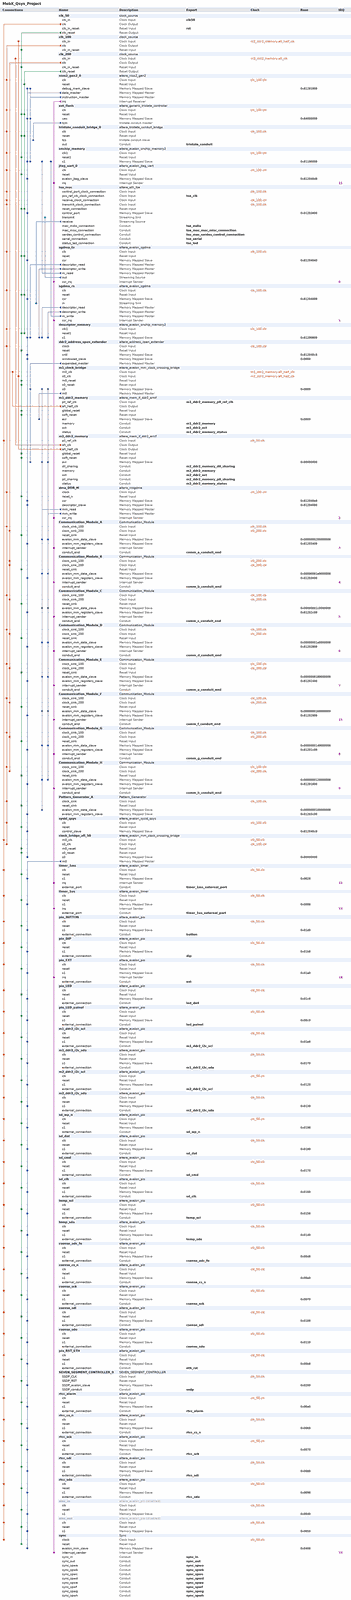
[diagram p0: system contents, whole]
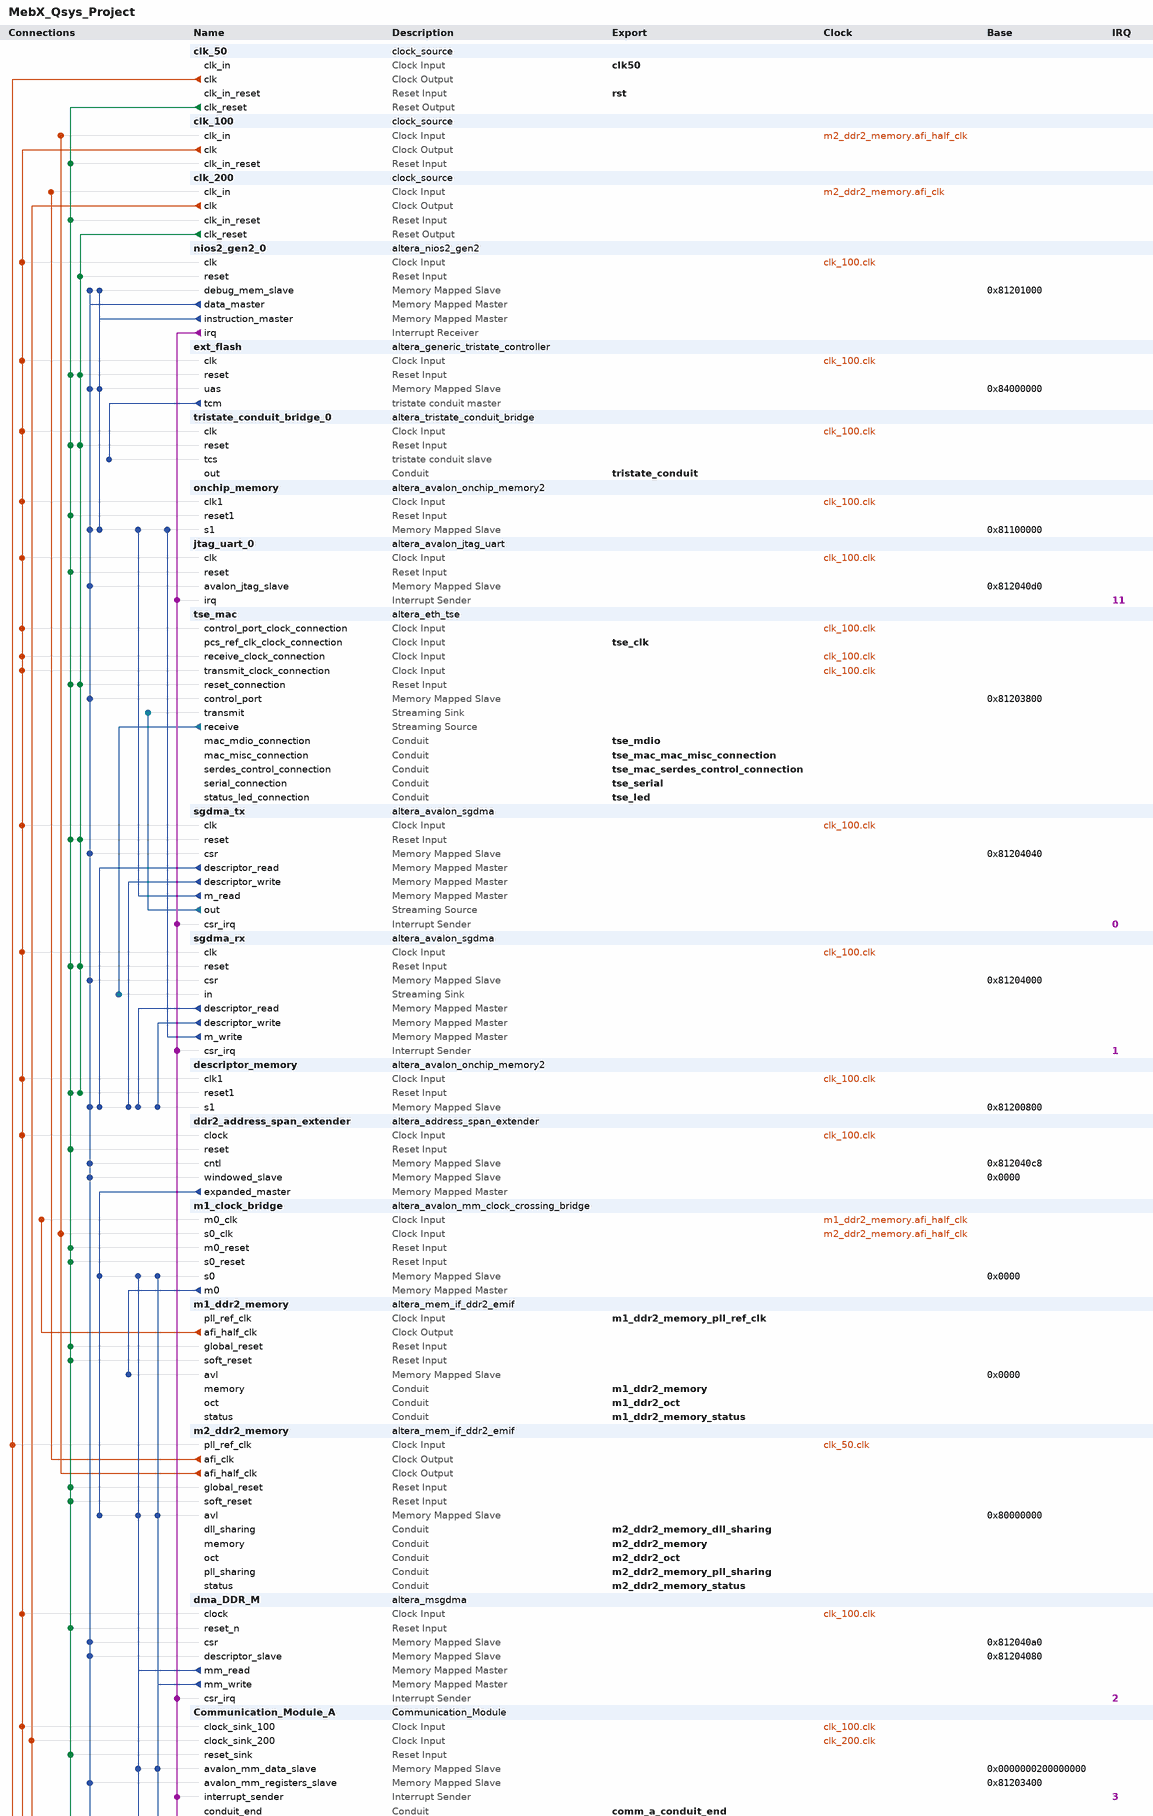
[diagram p1: system contents, upper part]
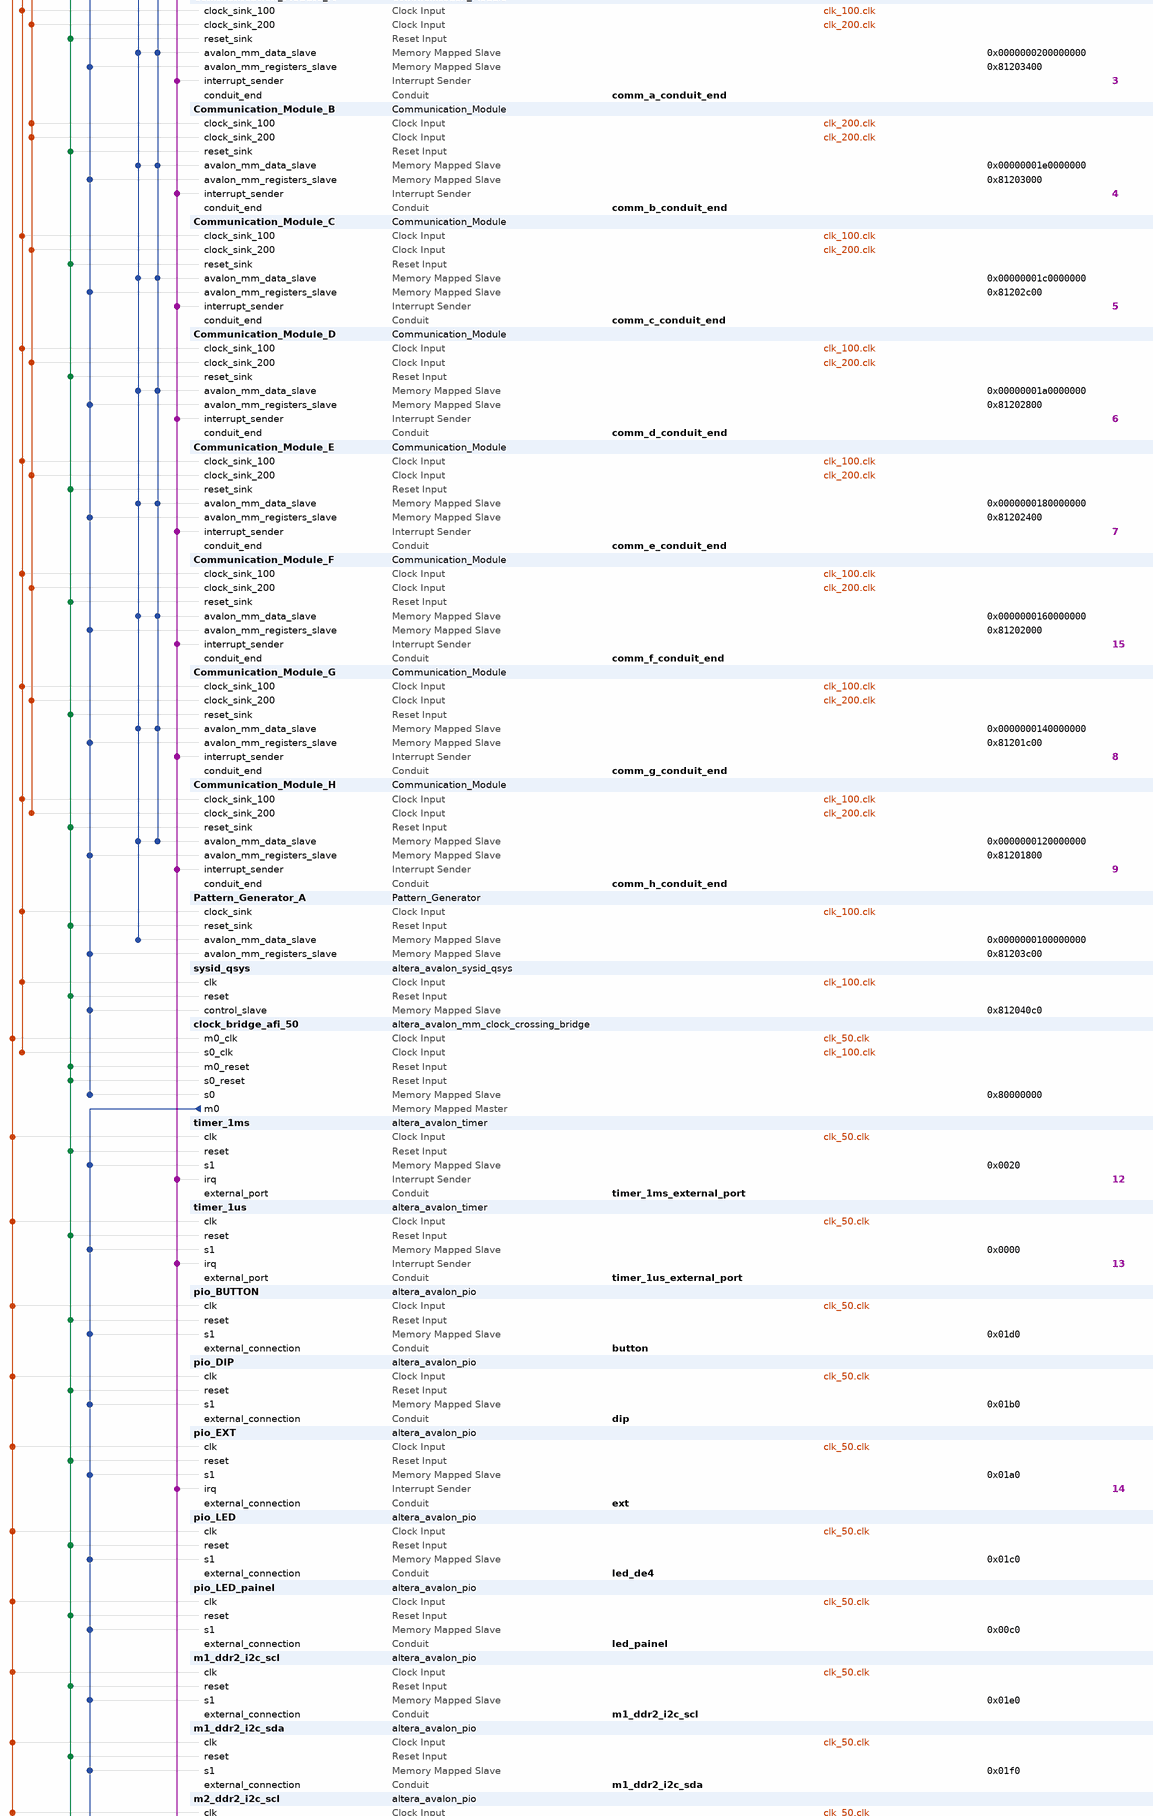
[diagram p2: system contents, middle part]
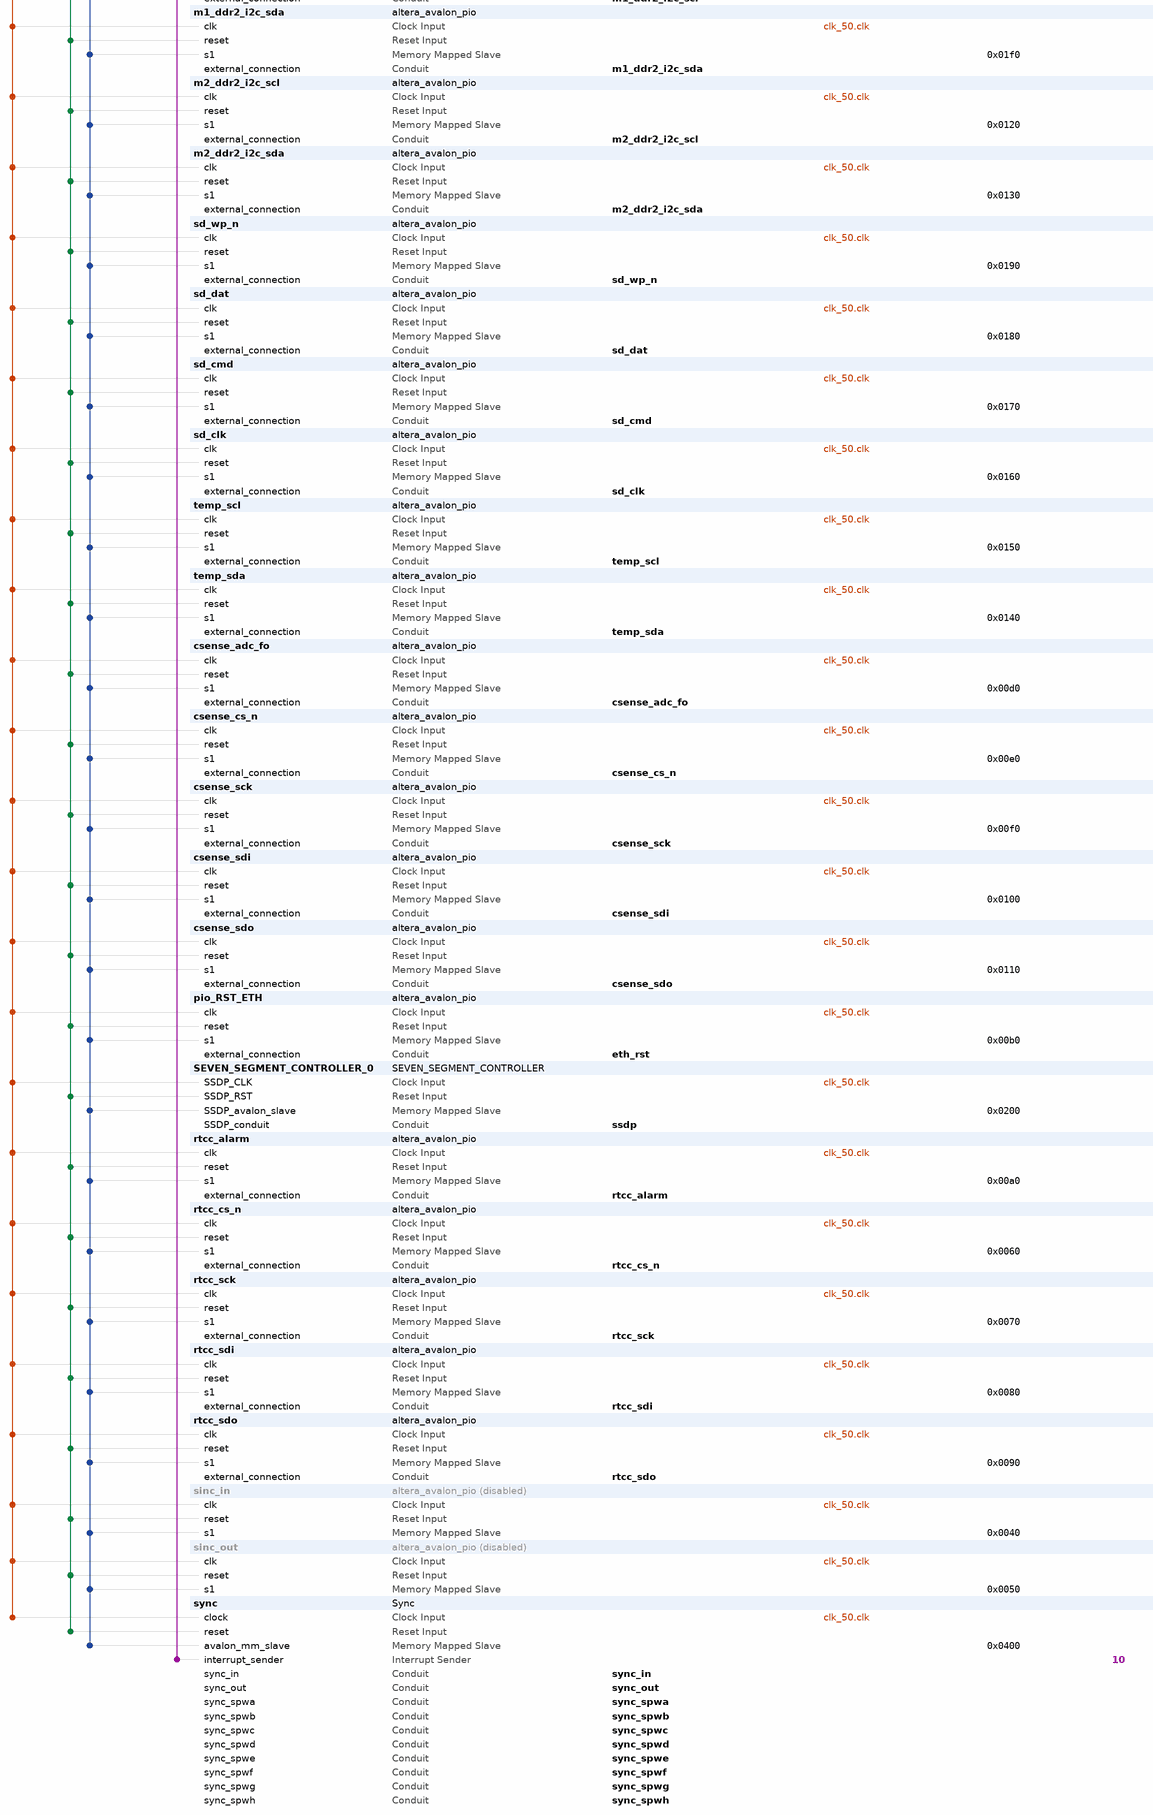
[diagram p3: system contents, lower part]
# Platform Designer (Qsys) system MebX_Qsys_Project, Stratix IV EP4SGX230KF40C2
# Parameters at their usual value, and those the tool derives, are not listed.
package require -exact qsys 16.1
create_system MebX_Qsys_Project
set_project_property DEVICE_FAMILY {Stratix IV}
set_project_property DEVICE EP4SGX230KF40C2

add_instance clk_50 clock_source 16.1
set_instance_parameter_value clk_50 clockFrequency 50000000

add_instance clk_100 clock_source 16.1
set_instance_parameter_value clk_100 clockFrequency 100000000

add_instance clk_200 clock_source 16.1
set_instance_parameter_value clk_200 clockFrequency 200000000

add_instance nios2_gen2_0 altera_nios2_gen2 16.1
set_instance_parameter_value nios2_gen2_0 dcache_size 0
set_instance_parameter_value nios2_gen2_0 debug_hwbreakpoint 2
set_instance_parameter_value nios2_gen2_0 dividerType srt2
set_instance_parameter_value nios2_gen2_0 exceptionSlave onchip_memory.s1
set_instance_parameter_value nios2_gen2_0 icache_burstType Sequential
set_instance_parameter_value nios2_gen2_0 icache_size 4096
set_instance_parameter_value nios2_gen2_0 impl Fast
set_instance_parameter_value nios2_gen2_0 mul_64_impl 1
set_instance_parameter_value nios2_gen2_0 mul_shift_choice 1
set_instance_parameter_value nios2_gen2_0 resetOffset 33685504
set_instance_parameter_value nios2_gen2_0 resetSlave ext_flash.uas
set_instance_parameter_value nios2_gen2_0 setting_support31bitdcachebypass false

add_instance ext_flash altera_generic_tristate_controller 16.1
set_instance_parameter_value ext_flash ACTIVE_LOW_BEGINTRANSFER 0
set_instance_parameter_value ext_flash ACTIVE_LOW_BYTEENABLE 0
set_instance_parameter_value ext_flash ACTIVE_LOW_OUTPUTENABLE 0
set_instance_parameter_value ext_flash ACTIVE_LOW_READ 1
set_instance_parameter_value ext_flash CHIPSELECT_THROUGH_READLATENCY 0
set_instance_parameter_value ext_flash INTERFACE_ASSIGNMENT_KEYS embeddedsw.configuration.isFlash,embeddedsw.configuration.isNonVolatileStorage,embeddedsw.configuration.isMemoryDevice
set_instance_parameter_value ext_flash INTERFACE_ASSIGNMENT_VALUES 1,1,1
set_instance_parameter_value ext_flash MODULE_ASSIGNMENT_KEYS embeddedsw.configuration.hwClassnameDriverSupportList,embeddedsw.configuration.hwClassnameDriverSupportDefault,embeddedsw.CMacro.SETUP_VALUE,embeddedsw.CMacro.WAIT_VALUE,embeddedsw.CMacro.HOLD_VALUE,embeddedsw.CMacro.TIMING_UNITS,embeddedsw.CMacro.SIZE,embeddedsw.memoryInfo.MEM_INIT_DATA_WIDTH,embeddedsw.memoryInfo.HAS_BYTE_LANE,embeddedsw.memoryInfo.IS_FLASH,embeddedsw.memoryInfo.GENERATE_DAT_SYM,embeddedsw.memoryInfo.GENERATE_FLASH,embeddedsw.memoryInfo.DAT_SYM_INSTALL_DIR,embeddedsw.memoryInfo.FLASH_INSTALL_DIR
set_instance_parameter_value ext_flash MODULE_ASSIGNMENT_VALUES "altera_avalon_lan91c111\\,altera_avalon_cfi_flash,altera_avalon_cfi_flash,25,100,20,\"ns\",33554432u,16,1,1,1,1,SIM_DIR,APP_DIR"
set_instance_parameter_value ext_flash TCM_ADDRESS_W 26
set_instance_parameter_value ext_flash TCM_BYTEENABLE_W 2
set_instance_parameter_value ext_flash TCM_DATA_HOLD 20
set_instance_parameter_value ext_flash TCM_DATA_W 16
set_instance_parameter_value ext_flash TCM_MAX_PENDING_READ_TRANSACTIONS 3
set_instance_parameter_value ext_flash TCM_READLATENCY 2
set_instance_parameter_value ext_flash TCM_READ_WAIT 100
set_instance_parameter_value ext_flash TCM_SETUP_WAIT 25
set_instance_parameter_value ext_flash TCM_SYMBOLS_PER_WORD 2
set_instance_parameter_value ext_flash TCM_TIMING_UNITS 0
set_instance_parameter_value ext_flash TCM_TURNAROUND_TIME 2
set_instance_parameter_value ext_flash TCM_WRITE_WAIT 100
set_instance_parameter_value ext_flash USE_BEGINTRANSFER 0
set_instance_parameter_value ext_flash USE_BYTEENABLE 0
set_instance_parameter_value ext_flash USE_OUTPUTENABLE 0
set_instance_parameter_value ext_flash USE_READ 1

add_instance tristate_conduit_bridge_0 altera_tristate_conduit_bridge 16.1

add_instance onchip_memory altera_avalon_onchip_memory2 16.1
set_instance_parameter_value onchip_memory blockType M9K
set_instance_parameter_value onchip_memory dataWidth 32
set_instance_parameter_value onchip_memory dualPort false
set_instance_parameter_value onchip_memory initMemContent false
set_instance_parameter_value onchip_memory initializationFileName onchip_mem.hex
set_instance_parameter_value onchip_memory memorySize 1024000

add_instance jtag_uart_0 altera_avalon_jtag_uart 16.1
set_instance_parameter_value jtag_uart_0 simInteractiveOptions NO_INTERACTIVE_WINDOWS

add_instance tse_mac altera_eth_tse 16.1
set_instance_parameter_value tse_mac core_variation MAC_PCS
set_instance_parameter_value tse_mac ena_hash true
set_instance_parameter_value tse_mac enable_hd_logic true
set_instance_parameter_value tse_mac enable_mac_flow_ctrl true
set_instance_parameter_value tse_mac enable_mac_vlan true
set_instance_parameter_value tse_mac enable_magic_detect true
set_instance_parameter_value tse_mac enable_sgmii true
set_instance_parameter_value tse_mac enable_shift16 true
set_instance_parameter_value tse_mac enable_sup_addr true
set_instance_parameter_value tse_mac ifGMII MII_GMII
set_instance_parameter_value tse_mac ing_addr 11
set_instance_parameter_value tse_mac mdio_clk_div 40
set_instance_parameter_value tse_mac phy_identifier 3
set_instance_parameter_value tse_mac stat_cnt_ena true
set_instance_parameter_value tse_mac transceiver_type LVDS_IO

add_instance sgdma_tx altera_avalon_sgdma 16.1
set_instance_parameter_value sgdma_tx enableBurstTransfers false
set_instance_parameter_value sgdma_tx enableUnalignedTransfers false
set_instance_parameter_value sgdma_tx readBlockDataWidth 32
set_instance_parameter_value sgdma_tx sinkErrorWidth 0
set_instance_parameter_value sgdma_tx sourceErrorWidth 0
set_instance_parameter_value sgdma_tx transferMode MEMORY_TO_STREAM
set_instance_parameter_value sgdma_tx writeBurstcountWidth 4

add_instance sgdma_rx altera_avalon_sgdma 16.1
set_instance_parameter_value sgdma_rx enableBurstTransfers false
set_instance_parameter_value sgdma_rx enableUnalignedTransfers false
set_instance_parameter_value sgdma_rx readBlockDataWidth 32
set_instance_parameter_value sgdma_rx sinkErrorWidth 0
set_instance_parameter_value sgdma_rx sourceErrorWidth 0
set_instance_parameter_value sgdma_rx transferMode STREAM_TO_MEMORY
set_instance_parameter_value sgdma_rx writeBurstcountWidth 4

add_instance descriptor_memory altera_avalon_onchip_memory2 16.1
set_instance_parameter_value descriptor_memory dataWidth 32
set_instance_parameter_value descriptor_memory dualPort false
set_instance_parameter_value descriptor_memory initMemContent true
set_instance_parameter_value descriptor_memory initializationFileName onchip_mem.hex
set_instance_parameter_value descriptor_memory memorySize 2048

add_instance ddr2_address_span_extender altera_address_span_extender 16.1
set_instance_parameter_value ddr2_address_span_extender BURSTCOUNT_WIDTH 8
set_instance_parameter_value ddr2_address_span_extender DATA_WIDTH 32
set_instance_parameter_value ddr2_address_span_extender ENABLE_SLAVE_PORT true
set_instance_parameter_value ddr2_address_span_extender MASTER_ADDRESS_DEF 0
set_instance_parameter_value ddr2_address_span_extender MAX_PENDING_READS 8
set_instance_parameter_value ddr2_address_span_extender SLAVE_ADDRESS_WIDTH 29

add_instance m1_clock_bridge altera_avalon_mm_clock_crossing_bridge 16.1
set_instance_parameter_value m1_clock_bridge ADDRESS_WIDTH 31
set_instance_parameter_value m1_clock_bridge COMMAND_FIFO_DEPTH 4
set_instance_parameter_value m1_clock_bridge DATA_WIDTH 64
set_instance_parameter_value m1_clock_bridge MASTER_SYNC_DEPTH 2
set_instance_parameter_value m1_clock_bridge MAX_BURST_SIZE 16
set_instance_parameter_value m1_clock_bridge RESPONSE_FIFO_DEPTH 64
set_instance_parameter_value m1_clock_bridge SLAVE_SYNC_DEPTH 2
set_instance_parameter_value m1_clock_bridge USE_AUTO_ADDRESS_WIDTH 1

add_instance m1_ddr2_memory altera_mem_if_ddr2_emif 16.1
set_instance_parameter_value m1_ddr2_memory AVL_MAX_SIZE 128
set_instance_parameter_value m1_ddr2_memory CALIBRATION_MODE Full
set_instance_parameter_value m1_ddr2_memory DLL_SHARING_MODE None
set_instance_parameter_value m1_ddr2_memory EXPORT_AFI_HALF_CLK true
set_instance_parameter_value m1_ddr2_memory MEM_BANKADDR_WIDTH 3
set_instance_parameter_value m1_ddr2_memory MEM_CLK_FREQ 400.0
set_instance_parameter_value m1_ddr2_memory MEM_COL_ADDR_WIDTH 10
set_instance_parameter_value m1_ddr2_memory MEM_DQ_WIDTH 64
set_instance_parameter_value m1_ddr2_memory MEM_NUMBER_OF_RANKS_PER_DIMM 2
set_instance_parameter_value m1_ddr2_memory MEM_ROW_ADDR_WIDTH 14
set_instance_parameter_value m1_ddr2_memory MEM_TCL 4
set_instance_parameter_value m1_ddr2_memory MEM_TRAS_NS 40.0
set_instance_parameter_value m1_ddr2_memory PLL_SHARING_MODE None
set_instance_parameter_value m1_ddr2_memory POWER_OF_TWO_BUS true
set_instance_parameter_value m1_ddr2_memory REF_CLK_FREQ 50.0
set_instance_parameter_value m1_ddr2_memory TIMING_TDQSQ 200
set_instance_parameter_value m1_ddr2_memory TIMING_TIH 375
set_instance_parameter_value m1_ddr2_memory TIMING_TQHS 300
set_instance_parameter_value m1_ddr2_memory USER_DEBUG_LEVEL 0

add_instance m2_ddr2_memory altera_mem_if_ddr2_emif 16.1
set_instance_parameter_value m2_ddr2_memory AVL_MAX_SIZE 128
set_instance_parameter_value m2_ddr2_memory CALIBRATION_MODE Full
set_instance_parameter_value m2_ddr2_memory DLL_SHARING_MODE Master
set_instance_parameter_value m2_ddr2_memory EXPORT_AFI_HALF_CLK true
set_instance_parameter_value m2_ddr2_memory MEM_BANKADDR_WIDTH 3
set_instance_parameter_value m2_ddr2_memory MEM_CLK_FREQ 400.0
set_instance_parameter_value m2_ddr2_memory MEM_COL_ADDR_WIDTH 10
set_instance_parameter_value m2_ddr2_memory MEM_DQ_WIDTH 64
set_instance_parameter_value m2_ddr2_memory MEM_NUMBER_OF_RANKS_PER_DIMM 2
set_instance_parameter_value m2_ddr2_memory MEM_ROW_ADDR_WIDTH 14
set_instance_parameter_value m2_ddr2_memory MEM_TCL 4
set_instance_parameter_value m2_ddr2_memory MEM_TRAS_NS 40.0
set_instance_parameter_value m2_ddr2_memory PLL_SHARING_MODE Master
set_instance_parameter_value m2_ddr2_memory POWER_OF_TWO_BUS true
set_instance_parameter_value m2_ddr2_memory REF_CLK_FREQ 50.0
set_instance_parameter_value m2_ddr2_memory TIMING_TDQSQ 200
set_instance_parameter_value m2_ddr2_memory TIMING_TIH 375
set_instance_parameter_value m2_ddr2_memory TIMING_TQHS 300
set_instance_parameter_value m2_ddr2_memory USER_DEBUG_LEVEL 0

add_instance dma_DDR_M altera_msgdma 16.1
set_instance_parameter_value dma_DDR_M BURST_ENABLE 1
set_instance_parameter_value dma_DDR_M DATA_FIFO_DEPTH 64
set_instance_parameter_value dma_DDR_M DATA_WIDTH 64
set_instance_parameter_value dma_DDR_M DESCRIPTOR_FIFO_DEPTH 32
set_instance_parameter_value dma_DDR_M ENHANCED_FEATURES 1
set_instance_parameter_value dma_DDR_M ERROR_ENABLE 0
set_instance_parameter_value dma_DDR_M MAX_BURST_COUNT 16
set_instance_parameter_value dma_DDR_M MAX_BYTE 67108864
set_instance_parameter_value dma_DDR_M MODE 0
set_instance_parameter_value dma_DDR_M PACKET_ENABLE 0
set_instance_parameter_value dma_DDR_M TRANSFER_TYPE {Aligned Accesses}

add_instance Communication_Module_A Communication_Module 1.4

add_instance Communication_Module_B Communication_Module 1.4

add_instance Communication_Module_C Communication_Module 1.4

add_instance Communication_Module_D Communication_Module 1.4

add_instance Communication_Module_E Communication_Module 1.4

add_instance Communication_Module_F Communication_Module 1.4

add_instance Communication_Module_G Communication_Module 1.4

add_instance Communication_Module_H Communication_Module 1.4

add_instance Pattern_Generator_A Pattern_Generator 1.0

add_instance sysid_qsys altera_avalon_sysid_qsys 16.1
set_instance_parameter_value sysid_qsys id 0

add_instance clock_bridge_afi_50 altera_avalon_mm_clock_crossing_bridge 16.1
set_instance_parameter_value clock_bridge_afi_50 ADDRESS_WIDTH 32
set_instance_parameter_value clock_bridge_afi_50 COMMAND_FIFO_DEPTH 4
set_instance_parameter_value clock_bridge_afi_50 DATA_WIDTH 32
set_instance_parameter_value clock_bridge_afi_50 MASTER_SYNC_DEPTH 2
set_instance_parameter_value clock_bridge_afi_50 MAX_BURST_SIZE 1
set_instance_parameter_value clock_bridge_afi_50 RESPONSE_FIFO_DEPTH 4
set_instance_parameter_value clock_bridge_afi_50 SLAVE_SYNC_DEPTH 2
set_instance_parameter_value clock_bridge_afi_50 USE_AUTO_ADDRESS_WIDTH 1

add_instance timer_1ms altera_avalon_timer 16.1
set_instance_parameter_value timer_1ms alwaysRun true
set_instance_parameter_value timer_1ms period 1
set_instance_parameter_value timer_1ms periodUnits MSEC
set_instance_parameter_value timer_1ms timeoutPulseOutput true

add_instance timer_1us altera_avalon_timer 16.1
set_instance_parameter_value timer_1us alwaysRun true
set_instance_parameter_value timer_1us period 1
set_instance_parameter_value timer_1us periodUnits USEC
set_instance_parameter_value timer_1us timeoutPulseOutput true

add_instance pio_BUTTON altera_avalon_pio 16.1
set_instance_parameter_value pio_BUTTON direction Input
set_instance_parameter_value pio_BUTTON width 4

add_instance pio_DIP altera_avalon_pio 16.1
set_instance_parameter_value pio_DIP direction Input
set_instance_parameter_value pio_DIP width 8

add_instance pio_EXT altera_avalon_pio 16.1
set_instance_parameter_value pio_EXT bitClearingEdgeCapReg true
set_instance_parameter_value pio_EXT captureEdge true
set_instance_parameter_value pio_EXT direction Input
set_instance_parameter_value pio_EXT generateIRQ true
set_instance_parameter_value pio_EXT width 1

add_instance pio_LED altera_avalon_pio 16.1
set_instance_parameter_value pio_LED direction Output
set_instance_parameter_value pio_LED width 8

add_instance pio_LED_painel altera_avalon_pio 16.1
set_instance_parameter_value pio_LED_painel direction Output
set_instance_parameter_value pio_LED_painel width 21

add_instance m1_ddr2_i2c_scl altera_avalon_pio 16.1
set_instance_parameter_value m1_ddr2_i2c_scl direction Output
set_instance_parameter_value m1_ddr2_i2c_scl width 1

add_instance m1_ddr2_i2c_sda altera_avalon_pio 16.1
set_instance_parameter_value m1_ddr2_i2c_sda direction Bidir
set_instance_parameter_value m1_ddr2_i2c_sda width 1

add_instance m2_ddr2_i2c_scl altera_avalon_pio 16.1
set_instance_parameter_value m2_ddr2_i2c_scl direction Output
set_instance_parameter_value m2_ddr2_i2c_scl width 1

add_instance m2_ddr2_i2c_sda altera_avalon_pio 16.1
set_instance_parameter_value m2_ddr2_i2c_sda direction Bidir
set_instance_parameter_value m2_ddr2_i2c_sda width 1

add_instance sd_wp_n altera_avalon_pio 16.1
set_instance_parameter_value sd_wp_n direction Input
set_instance_parameter_value sd_wp_n width 1

add_instance sd_dat altera_avalon_pio 16.1
set_instance_parameter_value sd_dat direction Bidir
set_instance_parameter_value sd_dat width 4

add_instance sd_cmd altera_avalon_pio 16.1
set_instance_parameter_value sd_cmd direction Bidir
set_instance_parameter_value sd_cmd width 1

add_instance sd_clk altera_avalon_pio 16.1
set_instance_parameter_value sd_clk direction Output
set_instance_parameter_value sd_clk width 1

add_instance temp_scl altera_avalon_pio 16.1
set_instance_parameter_value temp_scl direction Output
set_instance_parameter_value temp_scl width 1

add_instance temp_sda altera_avalon_pio 16.1
set_instance_parameter_value temp_sda direction Bidir
set_instance_parameter_value temp_sda width 1

add_instance csense_adc_fo altera_avalon_pio 16.1
set_instance_parameter_value csense_adc_fo direction Output
set_instance_parameter_value csense_adc_fo width 1

add_instance csense_cs_n altera_avalon_pio 16.1
set_instance_parameter_value csense_cs_n direction Output
set_instance_parameter_value csense_cs_n width 2

add_instance csense_sck altera_avalon_pio 16.1
set_instance_parameter_value csense_sck direction Output
set_instance_parameter_value csense_sck width 1

add_instance csense_sdi altera_avalon_pio 16.1
set_instance_parameter_value csense_sdi direction Output
set_instance_parameter_value csense_sdi width 1

add_instance csense_sdo altera_avalon_pio 16.1
set_instance_parameter_value csense_sdo direction Input
set_instance_parameter_value csense_sdo width 1

add_instance pio_RST_ETH altera_avalon_pio 16.1
set_instance_parameter_value pio_RST_ETH direction Output
set_instance_parameter_value pio_RST_ETH width 1

add_instance SEVEN_SEGMENT_CONTROLLER_0 SEVEN_SEGMENT_CONTROLLER 1.0

add_instance rtcc_alarm altera_avalon_pio 16.1
set_instance_parameter_value rtcc_alarm direction Input
set_instance_parameter_value rtcc_alarm width 1

add_instance rtcc_cs_n altera_avalon_pio 16.1
set_instance_parameter_value rtcc_cs_n direction Output
set_instance_parameter_value rtcc_cs_n width 1

add_instance rtcc_sck altera_avalon_pio 16.1
set_instance_parameter_value rtcc_sck direction Output
set_instance_parameter_value rtcc_sck width 1

add_instance rtcc_sdi altera_avalon_pio 16.1
set_instance_parameter_value rtcc_sdi direction Output
set_instance_parameter_value rtcc_sdi width 1

add_instance rtcc_sdo altera_avalon_pio 16.1
set_instance_parameter_value rtcc_sdo direction Input
set_instance_parameter_value rtcc_sdo width 1

add_instance sinc_in altera_avalon_pio 16.1
set_instance_property sinc_in ENABLED false
set_instance_parameter_value sinc_in direction Input
set_instance_parameter_value sinc_in width 1

add_instance sinc_out altera_avalon_pio 16.1
set_instance_property sinc_out ENABLED false
set_instance_parameter_value sinc_out direction Output
set_instance_parameter_value sinc_out width 1

add_instance sync Sync 1.0

# connections
add_connection clk_50.clk clock_bridge_afi_50.m0_clk clock
add_connection clk_50.clk csense_adc_fo.clk clock
add_connection clk_50.clk csense_cs_n.clk clock
add_connection clk_50.clk csense_sck.clk clock
add_connection clk_50.clk csense_sdi.clk clock
add_connection clk_50.clk csense_sdo.clk clock
add_connection clk_50.clk m1_ddr2_i2c_scl.clk clock
add_connection clk_50.clk m1_ddr2_i2c_sda.clk clock
add_connection clk_50.clk m2_ddr2_i2c_scl.clk clock
add_connection clk_50.clk m2_ddr2_i2c_sda.clk clock
add_connection clk_50.clk m2_ddr2_memory.pll_ref_clk clock
add_connection clk_50.clk pio_BUTTON.clk clock
add_connection clk_50.clk pio_DIP.clk clock
add_connection clk_50.clk pio_EXT.clk clock
add_connection clk_50.clk pio_LED.clk clock
add_connection clk_50.clk pio_LED_painel.clk clock
add_connection clk_50.clk pio_RST_ETH.clk clock
add_connection clk_50.clk rtcc_alarm.clk clock
add_connection clk_50.clk rtcc_cs_n.clk clock
add_connection clk_50.clk rtcc_sck.clk clock
add_connection clk_50.clk rtcc_sdi.clk clock
add_connection clk_50.clk rtcc_sdo.clk clock
add_connection clk_50.clk sd_clk.clk clock
add_connection clk_50.clk sd_cmd.clk clock
add_connection clk_50.clk sd_dat.clk clock
add_connection clk_50.clk sd_wp_n.clk clock
add_connection clk_50.clk SEVEN_SEGMENT_CONTROLLER_0.SSDP_CLK clock
add_connection clk_50.clk sinc_in.clk clock
add_connection clk_50.clk sinc_out.clk clock
add_connection clk_50.clk sync.clock clock
add_connection clk_50.clk temp_scl.clk clock
add_connection clk_50.clk temp_sda.clk clock
add_connection clk_50.clk timer_1ms.clk clock
add_connection clk_50.clk timer_1us.clk clock
add_connection clk_100.clk clock_bridge_afi_50.s0_clk clock
add_connection clk_100.clk Communication_Module_A.clock_sink_100 clock
add_connection clk_100.clk Communication_Module_C.clock_sink_100 clock
add_connection clk_100.clk Communication_Module_D.clock_sink_100 clock
add_connection clk_100.clk Communication_Module_E.clock_sink_100 clock
add_connection clk_100.clk Communication_Module_F.clock_sink_100 clock
add_connection clk_100.clk Communication_Module_G.clock_sink_100 clock
add_connection clk_100.clk Communication_Module_H.clock_sink_100 clock
add_connection clk_100.clk ddr2_address_span_extender.clock clock
add_connection clk_100.clk descriptor_memory.clk1 clock
add_connection clk_100.clk dma_DDR_M.clock clock
add_connection clk_100.clk ext_flash.clk clock
add_connection clk_100.clk jtag_uart_0.clk clock
add_connection clk_100.clk nios2_gen2_0.clk clock
add_connection clk_100.clk onchip_memory.clk1 clock
add_connection clk_100.clk Pattern_Generator_A.clock_sink clock
add_connection clk_100.clk sgdma_rx.clk clock
add_connection clk_100.clk sgdma_tx.clk clock
add_connection clk_100.clk sysid_qsys.clk clock
add_connection clk_100.clk tristate_conduit_bridge_0.clk clock
add_connection clk_100.clk tse_mac.control_port_clock_connection clock
add_connection clk_100.clk tse_mac.receive_clock_connection clock
add_connection clk_100.clk tse_mac.transmit_clock_connection clock
add_connection clk_200.clk Communication_Module_A.clock_sink_200 clock
add_connection clk_200.clk Communication_Module_B.clock_sink_100 clock
add_connection clk_200.clk Communication_Module_B.clock_sink_200 clock
add_connection clk_200.clk Communication_Module_C.clock_sink_200 clock
add_connection clk_200.clk Communication_Module_D.clock_sink_200 clock
add_connection clk_200.clk Communication_Module_E.clock_sink_200 clock
add_connection clk_200.clk Communication_Module_F.clock_sink_200 clock
add_connection clk_200.clk Communication_Module_G.clock_sink_200 clock
add_connection clk_200.clk Communication_Module_H.clock_sink_200 clock
add_connection m1_ddr2_memory.afi_half_clk m1_clock_bridge.m0_clk clock
add_connection m2_ddr2_memory.afi_clk clk_200.clk_in clock
add_connection m2_ddr2_memory.afi_half_clk clk_100.clk_in clock
add_connection m2_ddr2_memory.afi_half_clk m1_clock_bridge.s0_clk clock
add_connection clk_50.clk_reset clk_100.clk_in_reset reset
add_connection clk_50.clk_reset clk_200.clk_in_reset reset
add_connection clk_50.clk_reset clock_bridge_afi_50.m0_reset reset
add_connection clk_50.clk_reset clock_bridge_afi_50.s0_reset reset
add_connection clk_50.clk_reset Communication_Module_A.reset_sink reset
add_connection clk_50.clk_reset Communication_Module_B.reset_sink reset
add_connection clk_50.clk_reset Communication_Module_C.reset_sink reset
add_connection clk_50.clk_reset Communication_Module_D.reset_sink reset
add_connection clk_50.clk_reset Communication_Module_E.reset_sink reset
add_connection clk_50.clk_reset Communication_Module_F.reset_sink reset
add_connection clk_50.clk_reset Communication_Module_G.reset_sink reset
add_connection clk_50.clk_reset Communication_Module_H.reset_sink reset
add_connection clk_50.clk_reset csense_adc_fo.reset reset
add_connection clk_50.clk_reset csense_cs_n.reset reset
add_connection clk_50.clk_reset csense_sck.reset reset
add_connection clk_50.clk_reset csense_sdi.reset reset
add_connection clk_50.clk_reset csense_sdo.reset reset
add_connection clk_50.clk_reset ddr2_address_span_extender.reset reset
add_connection clk_50.clk_reset descriptor_memory.reset1 reset
add_connection clk_50.clk_reset dma_DDR_M.reset_n reset
add_connection clk_50.clk_reset ext_flash.reset reset
add_connection clk_50.clk_reset jtag_uart_0.reset reset
add_connection clk_50.clk_reset m1_clock_bridge.m0_reset reset
add_connection clk_50.clk_reset m1_clock_bridge.s0_reset reset
add_connection clk_50.clk_reset m1_ddr2_i2c_scl.reset reset
add_connection clk_50.clk_reset m1_ddr2_i2c_sda.reset reset
add_connection clk_50.clk_reset m1_ddr2_memory.global_reset reset
add_connection clk_50.clk_reset m1_ddr2_memory.soft_reset reset
add_connection clk_50.clk_reset m2_ddr2_i2c_scl.reset reset
add_connection clk_50.clk_reset m2_ddr2_i2c_sda.reset reset
add_connection clk_50.clk_reset m2_ddr2_memory.global_reset reset
add_connection clk_50.clk_reset m2_ddr2_memory.soft_reset reset
add_connection clk_50.clk_reset onchip_memory.reset1 reset
add_connection clk_50.clk_reset Pattern_Generator_A.reset_sink reset
add_connection clk_50.clk_reset pio_BUTTON.reset reset
add_connection clk_50.clk_reset pio_DIP.reset reset
add_connection clk_50.clk_reset pio_EXT.reset reset
add_connection clk_50.clk_reset pio_LED.reset reset
add_connection clk_50.clk_reset pio_LED_painel.reset reset
add_connection clk_50.clk_reset pio_RST_ETH.reset reset
add_connection clk_50.clk_reset rtcc_alarm.reset reset
add_connection clk_50.clk_reset rtcc_cs_n.reset reset
add_connection clk_50.clk_reset rtcc_sck.reset reset
add_connection clk_50.clk_reset rtcc_sdi.reset reset
add_connection clk_50.clk_reset rtcc_sdo.reset reset
add_connection clk_50.clk_reset sd_clk.reset reset
add_connection clk_50.clk_reset sd_cmd.reset reset
add_connection clk_50.clk_reset sd_dat.reset reset
add_connection clk_50.clk_reset sd_wp_n.reset reset
add_connection clk_50.clk_reset SEVEN_SEGMENT_CONTROLLER_0.SSDP_RST reset
add_connection clk_50.clk_reset sgdma_rx.reset reset
add_connection clk_50.clk_reset sgdma_tx.reset reset
add_connection clk_50.clk_reset sinc_in.reset reset
add_connection clk_50.clk_reset sinc_out.reset reset
add_connection clk_50.clk_reset sync.reset reset
add_connection clk_50.clk_reset sysid_qsys.reset reset
add_connection clk_50.clk_reset temp_scl.reset reset
add_connection clk_50.clk_reset temp_sda.reset reset
add_connection clk_50.clk_reset timer_1ms.reset reset
add_connection clk_50.clk_reset timer_1us.reset reset
add_connection clk_50.clk_reset tristate_conduit_bridge_0.reset reset
add_connection clk_50.clk_reset tse_mac.reset_connection reset
add_connection clk_200.clk_reset descriptor_memory.reset1 reset
add_connection clk_200.clk_reset ext_flash.reset reset
add_connection clk_200.clk_reset nios2_gen2_0.reset reset
add_connection clk_200.clk_reset sgdma_rx.reset reset
add_connection clk_200.clk_reset sgdma_tx.reset reset
add_connection clk_200.clk_reset tristate_conduit_bridge_0.reset reset
add_connection clk_200.clk_reset tse_mac.reset_connection reset
add_connection clock_bridge_afi_50.m0 csense_adc_fo.s1 avalon
set_connection_parameter_value clock_bridge_afi_50.m0/csense_adc_fo.s1 baseAddress 0x00d0
add_connection clock_bridge_afi_50.m0 csense_cs_n.s1 avalon
set_connection_parameter_value clock_bridge_afi_50.m0/csense_cs_n.s1 baseAddress 0x00e0
add_connection clock_bridge_afi_50.m0 csense_sck.s1 avalon
set_connection_parameter_value clock_bridge_afi_50.m0/csense_sck.s1 baseAddress 0x00f0
add_connection clock_bridge_afi_50.m0 csense_sdi.s1 avalon
set_connection_parameter_value clock_bridge_afi_50.m0/csense_sdi.s1 baseAddress 0x0100
add_connection clock_bridge_afi_50.m0 csense_sdo.s1 avalon
set_connection_parameter_value clock_bridge_afi_50.m0/csense_sdo.s1 baseAddress 0x0110
add_connection clock_bridge_afi_50.m0 m1_ddr2_i2c_scl.s1 avalon
set_connection_parameter_value clock_bridge_afi_50.m0/m1_ddr2_i2c_scl.s1 baseAddress 0x01e0
add_connection clock_bridge_afi_50.m0 m1_ddr2_i2c_sda.s1 avalon
set_connection_parameter_value clock_bridge_afi_50.m0/m1_ddr2_i2c_sda.s1 baseAddress 0x01f0
add_connection clock_bridge_afi_50.m0 m2_ddr2_i2c_scl.s1 avalon
set_connection_parameter_value clock_bridge_afi_50.m0/m2_ddr2_i2c_scl.s1 baseAddress 0x0120
add_connection clock_bridge_afi_50.m0 m2_ddr2_i2c_sda.s1 avalon
set_connection_parameter_value clock_bridge_afi_50.m0/m2_ddr2_i2c_sda.s1 baseAddress 0x0130
add_connection clock_bridge_afi_50.m0 pio_BUTTON.s1 avalon
set_connection_parameter_value clock_bridge_afi_50.m0/pio_BUTTON.s1 baseAddress 0x01d0
add_connection clock_bridge_afi_50.m0 pio_DIP.s1 avalon
set_connection_parameter_value clock_bridge_afi_50.m0/pio_DIP.s1 baseAddress 0x01b0
add_connection clock_bridge_afi_50.m0 pio_EXT.s1 avalon
set_connection_parameter_value clock_bridge_afi_50.m0/pio_EXT.s1 baseAddress 0x01a0
add_connection clock_bridge_afi_50.m0 pio_LED.s1 avalon
set_connection_parameter_value clock_bridge_afi_50.m0/pio_LED.s1 baseAddress 0x01c0
add_connection clock_bridge_afi_50.m0 pio_LED_painel.s1 avalon
set_connection_parameter_value clock_bridge_afi_50.m0/pio_LED_painel.s1 baseAddress 0x00c0
add_connection clock_bridge_afi_50.m0 pio_RST_ETH.s1 avalon
set_connection_parameter_value clock_bridge_afi_50.m0/pio_RST_ETH.s1 baseAddress 0x00b0
add_connection clock_bridge_afi_50.m0 rtcc_alarm.s1 avalon
set_connection_parameter_value clock_bridge_afi_50.m0/rtcc_alarm.s1 baseAddress 0x00a0
add_connection clock_bridge_afi_50.m0 rtcc_cs_n.s1 avalon
set_connection_parameter_value clock_bridge_afi_50.m0/rtcc_cs_n.s1 baseAddress 0x0060
add_connection clock_bridge_afi_50.m0 rtcc_sck.s1 avalon
set_connection_parameter_value clock_bridge_afi_50.m0/rtcc_sck.s1 baseAddress 0x0070
add_connection clock_bridge_afi_50.m0 rtcc_sdi.s1 avalon
set_connection_parameter_value clock_bridge_afi_50.m0/rtcc_sdi.s1 baseAddress 0x0080
add_connection clock_bridge_afi_50.m0 rtcc_sdo.s1 avalon
set_connection_parameter_value clock_bridge_afi_50.m0/rtcc_sdo.s1 baseAddress 0x0090
add_connection clock_bridge_afi_50.m0 sd_clk.s1 avalon
set_connection_parameter_value clock_bridge_afi_50.m0/sd_clk.s1 baseAddress 0x0160
add_connection clock_bridge_afi_50.m0 sd_cmd.s1 avalon
set_connection_parameter_value clock_bridge_afi_50.m0/sd_cmd.s1 baseAddress 0x0170
add_connection clock_bridge_afi_50.m0 sd_dat.s1 avalon
set_connection_parameter_value clock_bridge_afi_50.m0/sd_dat.s1 baseAddress 0x0180
add_connection clock_bridge_afi_50.m0 sd_wp_n.s1 avalon
set_connection_parameter_value clock_bridge_afi_50.m0/sd_wp_n.s1 baseAddress 0x0190
add_connection clock_bridge_afi_50.m0 SEVEN_SEGMENT_CONTROLLER_0.SSDP_avalon_slave avalon
set_connection_parameter_value clock_bridge_afi_50.m0/SEVEN_SEGMENT_CONTROLLER_0.SSDP_avalon_slave baseAddress 0x0200
add_connection clock_bridge_afi_50.m0 sinc_in.s1 avalon
set_connection_parameter_value clock_bridge_afi_50.m0/sinc_in.s1 baseAddress 0x0040
add_connection clock_bridge_afi_50.m0 sinc_out.s1 avalon
set_connection_parameter_value clock_bridge_afi_50.m0/sinc_out.s1 baseAddress 0x0050
add_connection clock_bridge_afi_50.m0 sync.avalon_mm_slave avalon
set_connection_parameter_value clock_bridge_afi_50.m0/sync.avalon_mm_slave baseAddress 0x0400
add_connection clock_bridge_afi_50.m0 temp_scl.s1 avalon
set_connection_parameter_value clock_bridge_afi_50.m0/temp_scl.s1 baseAddress 0x0150
add_connection clock_bridge_afi_50.m0 temp_sda.s1 avalon
set_connection_parameter_value clock_bridge_afi_50.m0/temp_sda.s1 baseAddress 0x0140
add_connection clock_bridge_afi_50.m0 timer_1ms.s1 avalon
set_connection_parameter_value clock_bridge_afi_50.m0/timer_1ms.s1 baseAddress 0x0020
add_connection clock_bridge_afi_50.m0 timer_1us.s1 avalon
set_connection_parameter_value clock_bridge_afi_50.m0/timer_1us.s1 baseAddress 0x0000
add_connection ddr2_address_span_extender.expanded_master m1_clock_bridge.s0 avalon
set_connection_parameter_value ddr2_address_span_extender.expanded_master/m1_clock_bridge.s0 baseAddress 0x0000
add_connection ddr2_address_span_extender.expanded_master m2_ddr2_memory.avl avalon
set_connection_parameter_value ddr2_address_span_extender.expanded_master/m2_ddr2_memory.avl baseAddress 0x80000000
add_connection dma_DDR_M.mm_read Communication_Module_A.avalon_mm_data_slave avalon
set_connection_parameter_value dma_DDR_M.mm_read/Communication_Module_A.avalon_mm_data_slave baseAddress 0x0000000200000000
add_connection dma_DDR_M.mm_read Communication_Module_B.avalon_mm_data_slave avalon
set_connection_parameter_value dma_DDR_M.mm_read/Communication_Module_B.avalon_mm_data_slave baseAddress 0x00000001e0000000
add_connection dma_DDR_M.mm_read Communication_Module_C.avalon_mm_data_slave avalon
set_connection_parameter_value dma_DDR_M.mm_read/Communication_Module_C.avalon_mm_data_slave baseAddress 0x00000001c0000000
add_connection dma_DDR_M.mm_read Communication_Module_D.avalon_mm_data_slave avalon
set_connection_parameter_value dma_DDR_M.mm_read/Communication_Module_D.avalon_mm_data_slave baseAddress 0x00000001a0000000
add_connection dma_DDR_M.mm_read Communication_Module_E.avalon_mm_data_slave avalon
set_connection_parameter_value dma_DDR_M.mm_read/Communication_Module_E.avalon_mm_data_slave baseAddress 0x0000000180000000
add_connection dma_DDR_M.mm_read Communication_Module_F.avalon_mm_data_slave avalon
set_connection_parameter_value dma_DDR_M.mm_read/Communication_Module_F.avalon_mm_data_slave baseAddress 0x0000000160000000
add_connection dma_DDR_M.mm_read Communication_Module_G.avalon_mm_data_slave avalon
set_connection_parameter_value dma_DDR_M.mm_read/Communication_Module_G.avalon_mm_data_slave baseAddress 0x0000000140000000
add_connection dma_DDR_M.mm_read Communication_Module_H.avalon_mm_data_slave avalon
set_connection_parameter_value dma_DDR_M.mm_read/Communication_Module_H.avalon_mm_data_slave baseAddress 0x0000000120000000
add_connection dma_DDR_M.mm_read m1_clock_bridge.s0 avalon
set_connection_parameter_value dma_DDR_M.mm_read/m1_clock_bridge.s0 baseAddress 0x0000
add_connection dma_DDR_M.mm_read m2_ddr2_memory.avl avalon
set_connection_parameter_value dma_DDR_M.mm_read/m2_ddr2_memory.avl baseAddress 0x80000000
add_connection dma_DDR_M.mm_read Pattern_Generator_A.avalon_mm_data_slave avalon
set_connection_parameter_value dma_DDR_M.mm_read/Pattern_Generator_A.avalon_mm_data_slave baseAddress 0x0000000100000000
add_connection dma_DDR_M.mm_write Communication_Module_A.avalon_mm_data_slave avalon
set_connection_parameter_value dma_DDR_M.mm_write/Communication_Module_A.avalon_mm_data_slave baseAddress 0x0000000200000000
add_connection dma_DDR_M.mm_write Communication_Module_B.avalon_mm_data_slave avalon
set_connection_parameter_value dma_DDR_M.mm_write/Communication_Module_B.avalon_mm_data_slave baseAddress 0x00000001e0000000
add_connection dma_DDR_M.mm_write Communication_Module_C.avalon_mm_data_slave avalon
set_connection_parameter_value dma_DDR_M.mm_write/Communication_Module_C.avalon_mm_data_slave baseAddress 0x00000001c0000000
add_connection dma_DDR_M.mm_write Communication_Module_D.avalon_mm_data_slave avalon
set_connection_parameter_value dma_DDR_M.mm_write/Communication_Module_D.avalon_mm_data_slave baseAddress 0x00000001a0000000
add_connection dma_DDR_M.mm_write Communication_Module_E.avalon_mm_data_slave avalon
set_connection_parameter_value dma_DDR_M.mm_write/Communication_Module_E.avalon_mm_data_slave baseAddress 0x0000000180000000
add_connection dma_DDR_M.mm_write Communication_Module_F.avalon_mm_data_slave avalon
set_connection_parameter_value dma_DDR_M.mm_write/Communication_Module_F.avalon_mm_data_slave baseAddress 0x0000000160000000
add_connection dma_DDR_M.mm_write Communication_Module_G.avalon_mm_data_slave avalon
set_connection_parameter_value dma_DDR_M.mm_write/Communication_Module_G.avalon_mm_data_slave baseAddress 0x0000000140000000
add_connection dma_DDR_M.mm_write Communication_Module_H.avalon_mm_data_slave avalon
set_connection_parameter_value dma_DDR_M.mm_write/Communication_Module_H.avalon_mm_data_slave baseAddress 0x0000000120000000
add_connection dma_DDR_M.mm_write m1_clock_bridge.s0 avalon
set_connection_parameter_value dma_DDR_M.mm_write/m1_clock_bridge.s0 baseAddress 0x0000
add_connection dma_DDR_M.mm_write m2_ddr2_memory.avl avalon
set_connection_parameter_value dma_DDR_M.mm_write/m2_ddr2_memory.avl baseAddress 0x80000000
add_connection m1_clock_bridge.m0 m1_ddr2_memory.avl avalon
set_connection_parameter_value m1_clock_bridge.m0/m1_ddr2_memory.avl baseAddress 0x0000
add_connection nios2_gen2_0.data_master clock_bridge_afi_50.s0 avalon
set_connection_parameter_value nios2_gen2_0.data_master/clock_bridge_afi_50.s0 baseAddress 0x80000000
add_connection nios2_gen2_0.data_master Communication_Module_A.avalon_mm_registers_slave avalon
set_connection_parameter_value nios2_gen2_0.data_master/Communication_Module_A.avalon_mm_registers_slave baseAddress 0x81203400
add_connection nios2_gen2_0.data_master Communication_Module_B.avalon_mm_registers_slave avalon
set_connection_parameter_value nios2_gen2_0.data_master/Communication_Module_B.avalon_mm_registers_slave baseAddress 0x81203000
add_connection nios2_gen2_0.data_master Communication_Module_C.avalon_mm_registers_slave avalon
set_connection_parameter_value nios2_gen2_0.data_master/Communication_Module_C.avalon_mm_registers_slave baseAddress 0x81202c00
add_connection nios2_gen2_0.data_master Communication_Module_D.avalon_mm_registers_slave avalon
set_connection_parameter_value nios2_gen2_0.data_master/Communication_Module_D.avalon_mm_registers_slave baseAddress 0x81202800
add_connection nios2_gen2_0.data_master Communication_Module_E.avalon_mm_registers_slave avalon
set_connection_parameter_value nios2_gen2_0.data_master/Communication_Module_E.avalon_mm_registers_slave baseAddress 0x81202400
add_connection nios2_gen2_0.data_master Communication_Module_F.avalon_mm_registers_slave avalon
set_connection_parameter_value nios2_gen2_0.data_master/Communication_Module_F.avalon_mm_registers_slave baseAddress 0x81202000
add_connection nios2_gen2_0.data_master Communication_Module_G.avalon_mm_registers_slave avalon
set_connection_parameter_value nios2_gen2_0.data_master/Communication_Module_G.avalon_mm_registers_slave baseAddress 0x81201c00
add_connection nios2_gen2_0.data_master Communication_Module_H.avalon_mm_registers_slave avalon
set_connection_parameter_value nios2_gen2_0.data_master/Communication_Module_H.avalon_mm_registers_slave baseAddress 0x81201800
add_connection nios2_gen2_0.data_master ddr2_address_span_extender.cntl avalon
set_connection_parameter_value nios2_gen2_0.data_master/ddr2_address_span_extender.cntl baseAddress 0x812040c8
add_connection nios2_gen2_0.data_master ddr2_address_span_extender.windowed_slave avalon
set_connection_parameter_value nios2_gen2_0.data_master/ddr2_address_span_extender.windowed_slave baseAddress 0x0000
add_connection nios2_gen2_0.data_master descriptor_memory.s1 avalon
set_connection_parameter_value nios2_gen2_0.data_master/descriptor_memory.s1 baseAddress 0x81200800
add_connection nios2_gen2_0.data_master dma_DDR_M.csr avalon
set_connection_parameter_value nios2_gen2_0.data_master/dma_DDR_M.csr baseAddress 0x812040a0
add_connection nios2_gen2_0.data_master dma_DDR_M.descriptor_slave avalon
set_connection_parameter_value nios2_gen2_0.data_master/dma_DDR_M.descriptor_slave baseAddress 0x81204080
add_connection nios2_gen2_0.data_master ext_flash.uas avalon
set_connection_parameter_value nios2_gen2_0.data_master/ext_flash.uas baseAddress 0x84000000
add_connection nios2_gen2_0.data_master jtag_uart_0.avalon_jtag_slave avalon
set_connection_parameter_value nios2_gen2_0.data_master/jtag_uart_0.avalon_jtag_slave baseAddress 0x812040d0
add_connection nios2_gen2_0.data_master nios2_gen2_0.debug_mem_slave avalon
set_connection_parameter_value nios2_gen2_0.data_master/nios2_gen2_0.debug_mem_slave baseAddress 0x81201000
add_connection nios2_gen2_0.data_master onchip_memory.s1 avalon
set_connection_parameter_value nios2_gen2_0.data_master/onchip_memory.s1 baseAddress 0x81100000
add_connection nios2_gen2_0.data_master Pattern_Generator_A.avalon_mm_registers_slave avalon
set_connection_parameter_value nios2_gen2_0.data_master/Pattern_Generator_A.avalon_mm_registers_slave baseAddress 0x81203c00
add_connection nios2_gen2_0.data_master sgdma_rx.csr avalon
set_connection_parameter_value nios2_gen2_0.data_master/sgdma_rx.csr baseAddress 0x81204000
add_connection nios2_gen2_0.data_master sgdma_tx.csr avalon
set_connection_parameter_value nios2_gen2_0.data_master/sgdma_tx.csr baseAddress 0x81204040
add_connection nios2_gen2_0.data_master sysid_qsys.control_slave avalon
set_connection_parameter_value nios2_gen2_0.data_master/sysid_qsys.control_slave baseAddress 0x812040c0
add_connection nios2_gen2_0.data_master tse_mac.control_port avalon
set_connection_parameter_value nios2_gen2_0.data_master/tse_mac.control_port baseAddress 0x81203800
add_connection nios2_gen2_0.instruction_master ext_flash.uas avalon
set_connection_parameter_value nios2_gen2_0.instruction_master/ext_flash.uas baseAddress 0x84000000
add_connection nios2_gen2_0.instruction_master nios2_gen2_0.debug_mem_slave avalon
set_connection_parameter_value nios2_gen2_0.instruction_master/nios2_gen2_0.debug_mem_slave baseAddress 0x81201000
add_connection nios2_gen2_0.instruction_master onchip_memory.s1 avalon
set_connection_parameter_value nios2_gen2_0.instruction_master/onchip_memory.s1 baseAddress 0x81100000
add_connection sgdma_rx.descriptor_read descriptor_memory.s1 avalon
set_connection_parameter_value sgdma_rx.descriptor_read/descriptor_memory.s1 baseAddress 0x81200800
add_connection sgdma_rx.descriptor_write descriptor_memory.s1 avalon
set_connection_parameter_value sgdma_rx.descriptor_write/descriptor_memory.s1 baseAddress 0x81200800
add_connection sgdma_rx.m_write onchip_memory.s1 avalon
set_connection_parameter_value sgdma_rx.m_write/onchip_memory.s1 baseAddress 0x81100000
add_connection sgdma_tx.descriptor_read descriptor_memory.s1 avalon
set_connection_parameter_value sgdma_tx.descriptor_read/descriptor_memory.s1 baseAddress 0x81200800
add_connection sgdma_tx.descriptor_write descriptor_memory.s1 avalon
set_connection_parameter_value sgdma_tx.descriptor_write/descriptor_memory.s1 baseAddress 0x81200800
add_connection sgdma_tx.m_read onchip_memory.s1 avalon
set_connection_parameter_value sgdma_tx.m_read/onchip_memory.s1 baseAddress 0x81100000
add_connection sgdma_tx.out tse_mac.transmit avalon_streaming
add_connection tse_mac.receive sgdma_rx.in avalon_streaming
add_connection nios2_gen2_0.irq Communication_Module_A.interrupt_sender interrupt
set_connection_parameter_value nios2_gen2_0.irq/Communication_Module_A.interrupt_sender irqNumber 3
add_connection nios2_gen2_0.irq Communication_Module_B.interrupt_sender interrupt
set_connection_parameter_value nios2_gen2_0.irq/Communication_Module_B.interrupt_sender irqNumber 4
add_connection nios2_gen2_0.irq Communication_Module_C.interrupt_sender interrupt
set_connection_parameter_value nios2_gen2_0.irq/Communication_Module_C.interrupt_sender irqNumber 5
add_connection nios2_gen2_0.irq Communication_Module_D.interrupt_sender interrupt
set_connection_parameter_value nios2_gen2_0.irq/Communication_Module_D.interrupt_sender irqNumber 6
add_connection nios2_gen2_0.irq Communication_Module_E.interrupt_sender interrupt
set_connection_parameter_value nios2_gen2_0.irq/Communication_Module_E.interrupt_sender irqNumber 7
add_connection nios2_gen2_0.irq Communication_Module_F.interrupt_sender interrupt
set_connection_parameter_value nios2_gen2_0.irq/Communication_Module_F.interrupt_sender irqNumber 15
add_connection nios2_gen2_0.irq Communication_Module_G.interrupt_sender interrupt
set_connection_parameter_value nios2_gen2_0.irq/Communication_Module_G.interrupt_sender irqNumber 8
add_connection nios2_gen2_0.irq Communication_Module_H.interrupt_sender interrupt
set_connection_parameter_value nios2_gen2_0.irq/Communication_Module_H.interrupt_sender irqNumber 9
add_connection nios2_gen2_0.irq dma_DDR_M.csr_irq interrupt
set_connection_parameter_value nios2_gen2_0.irq/dma_DDR_M.csr_irq irqNumber 2
add_connection nios2_gen2_0.irq jtag_uart_0.irq interrupt
set_connection_parameter_value nios2_gen2_0.irq/jtag_uart_0.irq irqNumber 11
add_connection nios2_gen2_0.irq pio_EXT.irq interrupt
set_connection_parameter_value nios2_gen2_0.irq/pio_EXT.irq irqNumber 14
add_connection nios2_gen2_0.irq sgdma_rx.csr_irq interrupt
set_connection_parameter_value nios2_gen2_0.irq/sgdma_rx.csr_irq irqNumber 1
add_connection nios2_gen2_0.irq sgdma_tx.csr_irq interrupt
set_connection_parameter_value nios2_gen2_0.irq/sgdma_tx.csr_irq irqNumber 0
add_connection nios2_gen2_0.irq sync.interrupt_sender interrupt
set_connection_parameter_value nios2_gen2_0.irq/sync.interrupt_sender irqNumber 10
add_connection nios2_gen2_0.irq timer_1ms.irq interrupt
set_connection_parameter_value nios2_gen2_0.irq/timer_1ms.irq irqNumber 12
add_connection nios2_gen2_0.irq timer_1us.irq interrupt
set_connection_parameter_value nios2_gen2_0.irq/timer_1us.irq irqNumber 13
add_connection ext_flash.tcm tristate_conduit_bridge_0.tcs tristate_conduit
